# EAGLE schematic MotorControl (EAGLE 9.6.2)
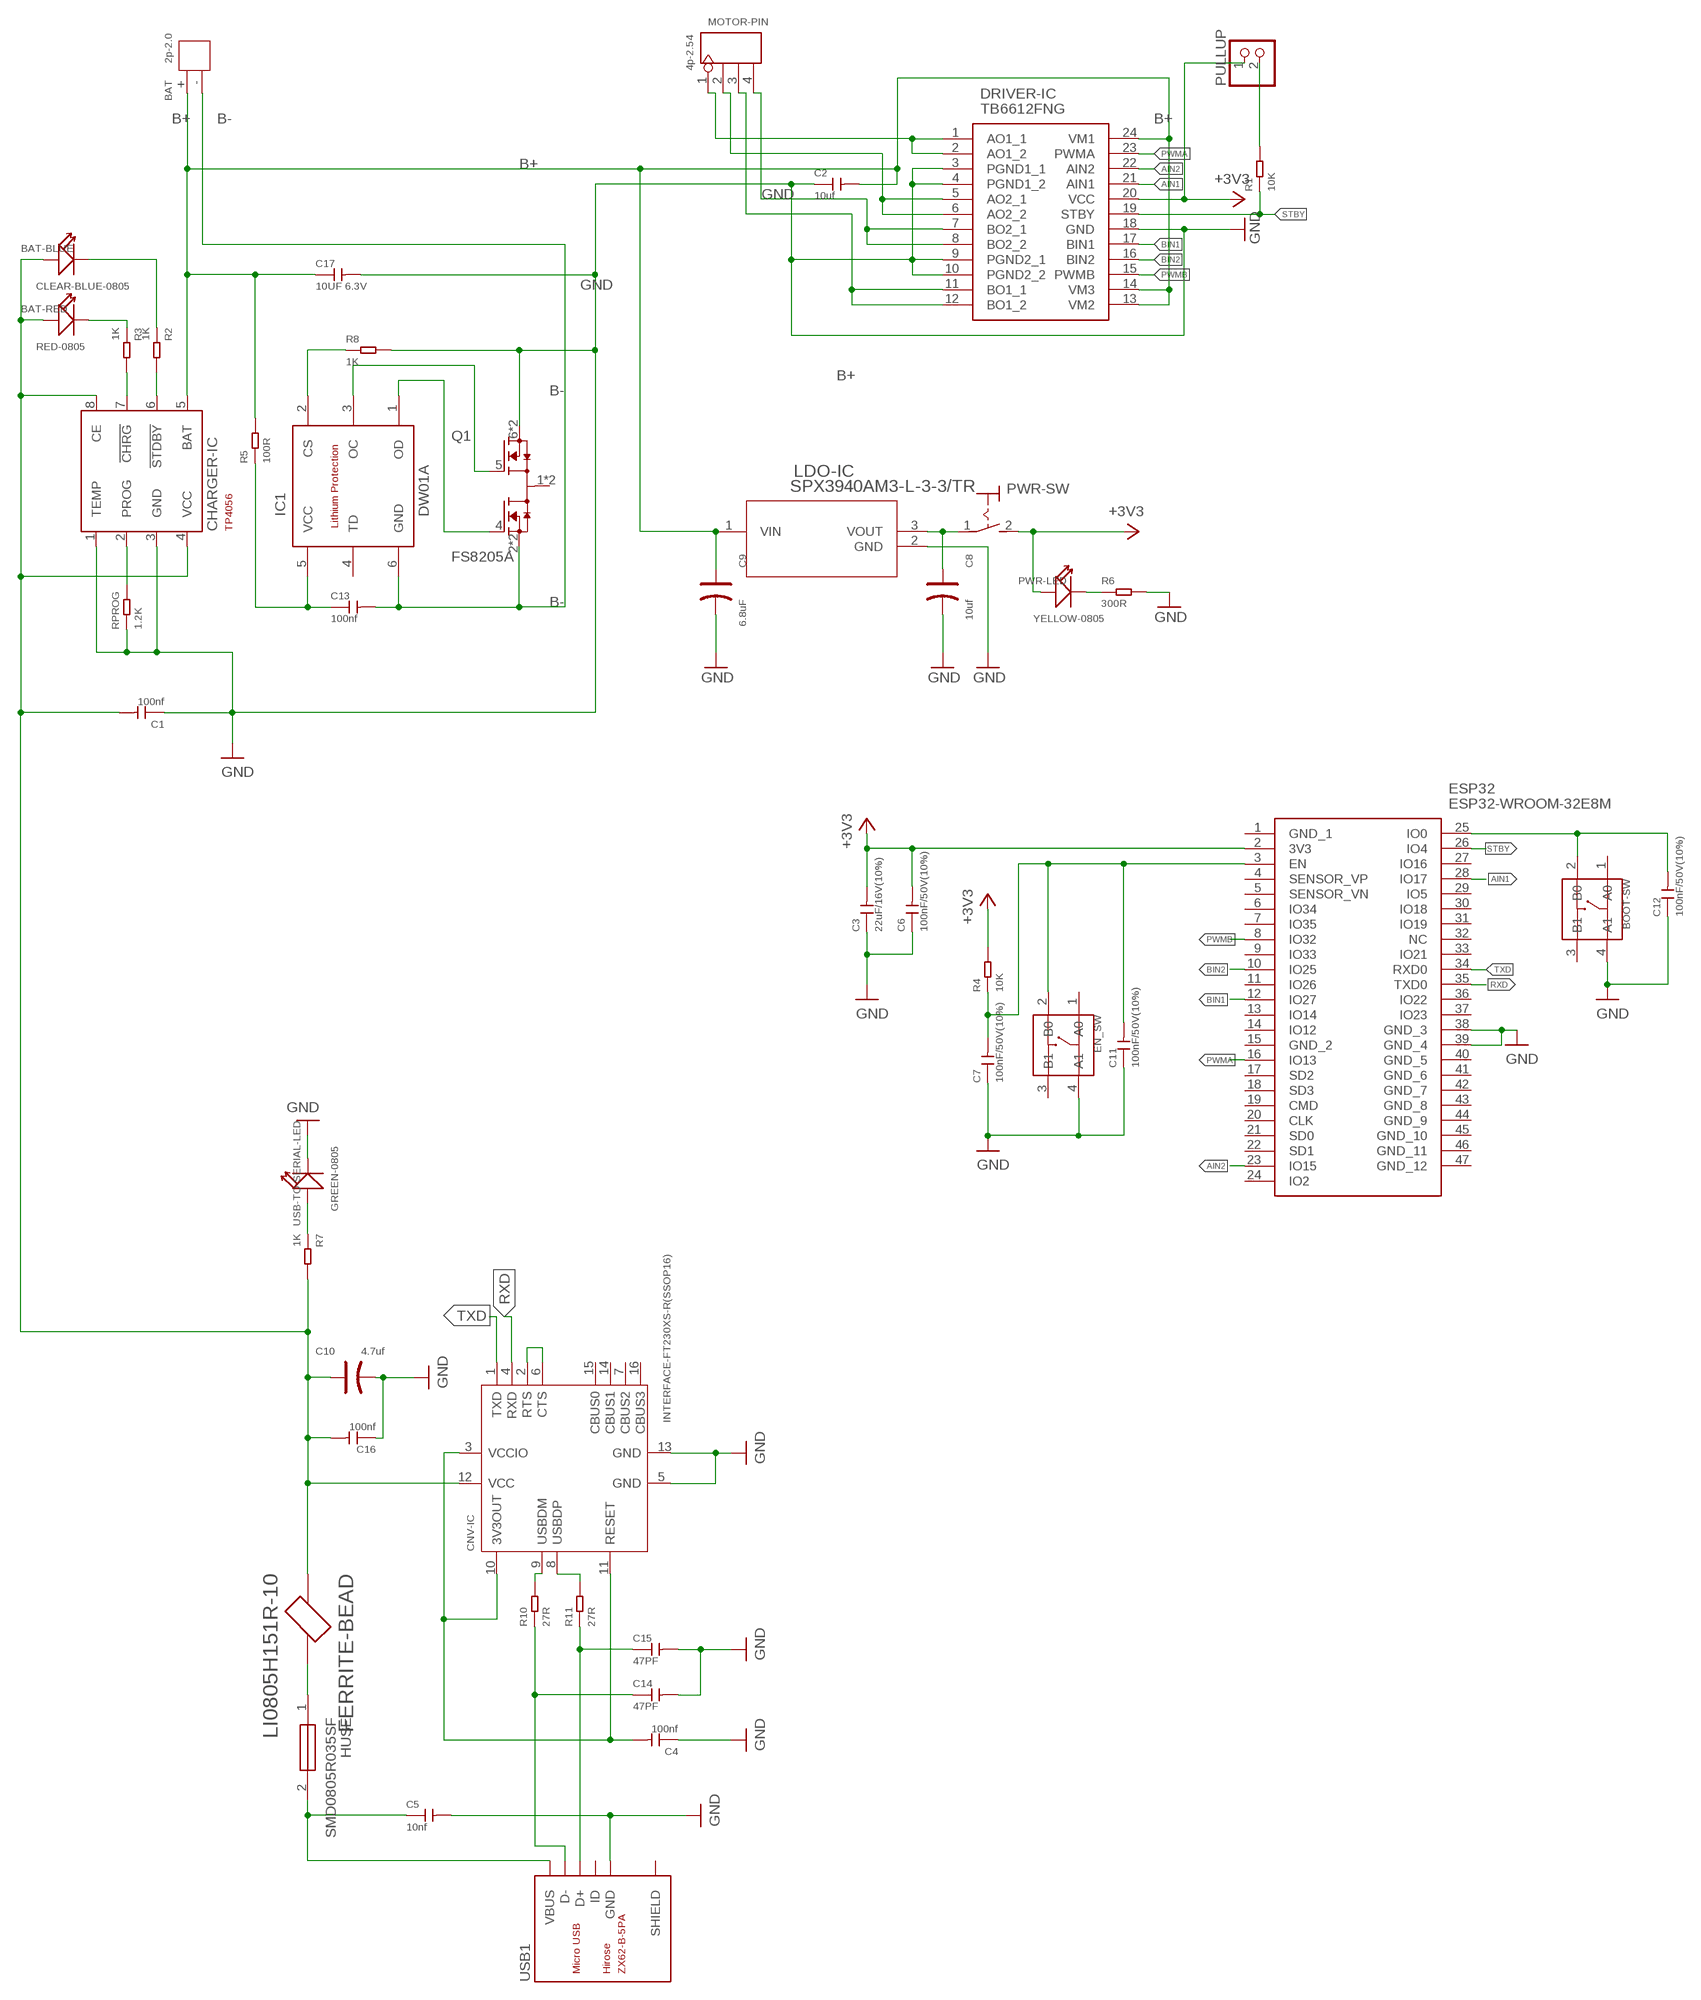
[diagram p0: schematic, sheet 1]

## Parts
BAT  2p-2.0  DIP-JST-2P-2.0  [H2-2.0-6X4.5MM]
BAT-BLUE  CLEAR-BLUE-0805  SMD-LED-CLEAR-BLUE(0805)  [LED-0805]
BAT-RED  RED-0805  SMD-LED-CLEAR-RED(0805)  [LED-0805]
BOOT-SW  SMD-SWITCH-TACTILE-SPST-NO(4P-D6.0MM)  [SW4-SMD-6.0X6.0X5.0MM]
C1  100nf  CERAMIC-100NF-50V-10%-X7R(0805)  [C0805]
C2  10uf  CERAMIC-10UF-25V-10%-X5R(1206)  [C1206]
C3  22uF/16V(10%)  CERAMIC-22UF-16V-10%-X7R(1206)  [C1206]
C4  100nf  CERAMIC-100NF-50V-10%-X7R(0805)  [C0805]
C5  10nf  CERAMIC-10NF-50V-5%-X7R(0805)  [C0805]
C6  100nF/50V(10%)  CERAMIC-100NF-50V-10%-X7R(0603)  [C0603]
C7  100nF/50V(10%)  CERAMIC-100NF-50V-10%-X7R(0603)  [C0603]
C8  10uf  TANTALUM-SMD-10UF-16V-10%(AVX-A)  [AVX-A]
C9  6.8uF  TCJB685M025R0150-SELFMADE  [CAPPM3528X210N]
C10  4.7uf  TANTALUM-SMD-4.7UF-16V(AVX-A)  [AVX-A]
C11  100nF/50V(10%)  CERAMIC-100NF-50V-10%-X7R(0603)  [C0603]
C12  100nF/50V(10%)  CERAMIC-100NF-50V-10%-X7R(0603)  [C0603]
C13  100nf  CERAMIC-100NF-50V-10%-X7R(0805)  [C0805]
C14  47PF  CERAMIC-47PF-50V-5%-NP0(0402)  [C0402]
C15  47PF  CERAMIC-47PF-50V-5%-NP0(0402)  [C0402]
C16  100nf  CERAMIC-100NF-50V-10%-X7R(0805)  [C0805]
C17  10UF 6.3V  CERAMIC-10UF-6.3V-20%-X5R(0603)  [C0603]
CHARGER-IC  TP4056  [SOT23-8]
CNV-IC  INTERFACE-FT230XS-R(SSOP16)  [SSOP16-0.635-5X4MM]
DRIVER-IC  TB6612FNG  [SOP65P760X160-24N]
EN_SW  SMD-SWITCH-TACTILE-SPST-NO(4P-D6.0MM)  [SW4-SMD-6.0X6.0X5.0MM]
ESP32  ESP32-WROOM-32E8M  [ESP32WROOM32E8MB]
FERRITE-BEAD  LI0805H151R-10  [FB_LI0805H151R-10]
HUSE  SMD0805R035SF  [SMD0805R035SF]
IC1  DW01A  [SOT23-6]
LDO-IC  SPX3940AM3-L-3-3/TR  [SOT-223-3_VAR-AA]
MOTOR-PIN  4p-2.54  DIP-BLACK-FEMALE-HEADER-VERT(4P-2.54)  [H4-2.54]
PULLUP  PINHD-1X2  [1X02]
PWR-LED  YELLOW-0805  SMD-LED-CLEAR-YELLOW(0805)  [LED-0805]
PWR-SW  MS243  [MS243]
Q1  FS8205A  [SOP65P640X120-8N]
R1  10K  SMD-RES-10K-1%-1/10W(0603)  [R0603]
R2  1K  SMD-RES-1K-1%-1/10W(0603)  [R0603]
R3  1K  SMD-RES-1K-1%-1/10W(0603)  [R0603]
R4  10K  SMD-RES-10K-1%-1/10W(0603)  [R0603]
R5  100R  SMD-RES-100R-5%-1/4W(1206)  [R1206]
R6  300R  SMD-RES-300R-1%-1/10W(0603)  [R0603]
R7  1K  SMD-RES-1K-1%-1/10W(0603)  [R0603]
R8  1K  SMD-RES-1K-5%-1/8W(0805)  [R0805]
R10  27R  SMD-RES-27R-1%-1/8W(0805)  [R0805]
R11  27R  SMD-RES-27R-1%-1/8W(0805)  [R0805]
RPROG  1.2K  SMD-RES-1.2K-1%-1/8W(0805)  [R0805]
USB1  ZX62-B-5PA  MICRO-USB-SMD(ZX62-B-5PA)  [MICRO-USB5+6P-SMD-0.65-AB]
USB-TO-SERIAL-LED  GREEN-0805  SMD-LED-CLEAR-GREEN(0805)  [LED-0805]

## Nets
+3V3 [Power]: C3.2 C6.2 DRIVER-IC.20(VCC) ESP32.2(3V3) PULLUP.1 PWR-LED.+ PWR-SW.2(S) R4.2
AIN1: DRIVER-IC.21(AIN1) ESP32.28(IO17)
AIN2: DRIVER-IC.22(AIN2) ESP32.23(IO15)
AO1 [Motor]: DRIVER-IC.1(AO1_1) DRIVER-IC.2(AO1_2) MOTOR-PIN.1
AO2 [Motor]: DRIVER-IC.5(AO2_1) DRIVER-IC.6(AO2_2) MOTOR-PIN.2
B+ [Power]: BAT.+ C2.2 C9.1(+) C17.1 CHARGER-IC.5(BAT) DRIVER-IC.13(VM2) DRIVER-IC.14(VM3) DRIVER-IC.24(VM1) LDO-IC.1(VIN) R5.2
B- [Power]: BAT.- C13.2 IC1.6(GND) Q1.2(S1) Q1.3(S1)
BIN1: DRIVER-IC.17(BIN1) ESP32.12(IO27)
BIN2: DRIVER-IC.16(BIN2) ESP32.10(IO25)
BO1 [Motor]: DRIVER-IC.11(BO1_1) DRIVER-IC.12(BO1_2) MOTOR-PIN.3
BO2 [Motor]: DRIVER-IC.7(BO2_1) DRIVER-IC.8(BO2_2) MOTOR-PIN.4
GND [Power]: BOOT-SW.4(A1) C1.1 C2.1 C3.1 C4.1 C5.2 C6.1 C7.1 C8.- C9.2(-) C10.- C11.1 C12.1 C14.2 C15.2 C16.1 C17.2 CHARGER-IC.1(TEMP) CHARGER-IC.3(GND) CNV-IC.5(GND) CNV-IC.13(GND) DRIVER-IC.3(PGND1_1) DRIVER-IC.4(PGND1_2) DRIVER-IC.9(PGND2_1) DRIVER-IC.10(PGND2_2) DRIVER-IC.18(GND) EN_SW.4(A1) ESP32.38(GND_3) ESP32.39(GND_4) LDO-IC.2(GND) Q1.6(S2) Q1.7(S2) R6.2 R8.2 RPROG.1 USB1.5(GND) USB-TO-SERIAL-LED.-
N$1: IC1.3(OC) Q1.5(G2)
N$2: BAT-RED.- R3.1
N$3: R7.1 USB-TO-SERIAL-LED.+
N$4: FERRITE-BEAD.2 HUSE.1
N$5: C4.2 CNV-IC.3(VCCIO) CNV-IC.10(3V3OUT) CNV-IC.11(RESET)
N$6: CNV-IC.2(RTS) CNV-IC.6(CTS)
N$7: CNV-IC.9(USBDM) R10.2
N$8: CNV-IC.8(USBDP) R11.2
N$9: C14.1 R10.1 USB1.2(D-)
N$10: IC1.1(OD) Q1.4(G1)
N$11: CHARGER-IC.7(!CHRG) R3.2
N$12: CHARGER-IC.6(!STDBY) R2.2
N$13: BAT-BLUE.- R2.1
N$14: PWR-LED.- R6.1
N$15: C15.1 R11.1 USB1.3(D+)
N$16: CHARGER-IC.2(PROG) RPROG.2
N$18: C13.1 IC1.5(VCC) R5.1
N$19: IC1.2(CS) R8.1
N$25: PULLUP.2 R1.2
N$29: C7.2 C11.2 EN_SW.2(B0) ESP32.3(EN) R4.1
N$30: BOOT-SW.2(B0) C12.2 ESP32.25(IO0)
POWER_SW: C8.+ LDO-IC.3(VOUT) PWR-SW.1(P)
PWMA: DRIVER-IC.23(PWMA) ESP32.16(IO13)
PWMB: DRIVER-IC.15(PWMB) ESP32.8(IO32)
RXD: CNV-IC.4(RXD) ESP32.35(TXD0)
STBY: DRIVER-IC.19(STBY) ESP32.26(IO4) R1.1
TXD: CNV-IC.1(TXD) ESP32.34(RXD0)
VBUS [Power]: C5.1 HUSE.2 USB1.1(VBUS)
VIN+ [Power]: BAT-BLUE.+ BAT-RED.+ C1.2 C10.+ C16.2 CHARGER-IC.4(VCC) CHARGER-IC.8(CE) CNV-IC.12(VCC) FERRITE-BEAD.1 R7.2
Unconnected: BOOT-SW.1(A0) BOOT-SW.3(B1) CNV-IC.7(CBUS2) CNV-IC.14(CBUS1) CNV-IC.15(CBUS0) CNV-IC.16(CBUS3) EN_SW.1(A0) EN_SW.3(B1) ESP32.1(GND_1) ESP32.4(SENSOR_VP) ESP32.5(SENSOR_VN) ESP32.6(IO34) ESP32.7(IO35) ESP32.9(IO33) ESP32.11(IO26) ESP32.13(IO14) ESP32.14(IO12) ESP32.15(GND_2) ESP32.17(SD2) ESP32.18(SD3) ESP32.19(CMD) ESP32.20(CLK) ESP32.21(SD0) ESP32.22(SD1) ESP32.24(IO2) ESP32.27(IO16) ESP32.29(IO5) ESP32.30(IO18) ESP32.31(IO19) ESP32.32(NC) ESP32.33(IO21) ESP32.36(IO22) ESP32.37(IO23) ESP32.40(GND_5) ESP32.41(GND_6) ESP32.42(GND_7) ESP32.43(GND_8) ESP32.44(GND_9) ESP32.45(GND_10) ESP32.46(GND_11) ESP32.47(GND_12) IC1.4(TD) Q1.1(D12) Q1.8(D12) USB1.4(ID) USB1.P1(SHIELD) USB1.P2(SHIELD) USB1.P3(SHIELD) USB1.P4(SHIELD) USB1.P5(SHIELD) USB1.P6(SHIELD)

## Library data of the parts
BAT = OPL_Connector:DIP-JST-2P-2.0: 320110049
BAT-BLUE = OPL_Optoelectronics:SMD-LED-CLEAR-BLUE(0805): 304090061; MPN: EL-17-215/BHC-AN1P2/3T
BAT-RED = OPL_Optoelectronics:SMD-LED-CLEAR-RED(0805): 304090046; MPN: 17-215SURC/S530-A2/TR8
BOOT-SW EN_SW = OPL_Switch:SMD-SWITCH-TACTILE-SPST-NO(4P-D6.0MM): 311020004; MPN: DTSM-62K-S-V-T/R(SN431)
C1 C4 C13 C16 = OPL_Capacitor:CERAMIC-100NF-50V-10%-X7R(0805): 302010165; MPN: CC0805KRX7R9BB104
C2 = OPL_Capacitor:CERAMIC-10UF-25V-10%-X5R(1206): 302010181; MPN: CC1206KKX5R8BB106
C3 = OPL_Capacitor:CERAMIC-22UF-16V-10%-X7R(1206): 302010182
C5 = OPL_Capacitor:CERAMIC-10NF-50V-5%-X7R(0805): 302010175; MPN: CC0805JRX7R9BB103
C6 C7 C11 C12 = OPL_Capacitor:CERAMIC-100NF-50V-10%-X7R(0603): 302010138; MPN: CC0603KRX7R9BB104; VALUE: 100nf
C8 = OPL_Capacitor:TANTALUM-SMD-10UF-16V-10%(AVX-A): 302020002; MPN: TAJA106K016RNJ
C9 = TCJB685M025R0150:TCJB685M025R0150-SELFMADE; MPN: TCJB685M025R0150
C10 = OPL_Capacitor:TANTALUM-SMD-4.7UF-16V(AVX-A): 302020006; MPN: TAJA475*016#NJ
C14 C15 = OPL_Capacitor:CERAMIC-47PF-50V-5%-NP0(0402): 302010007; MPN: CC0402JRNPO9BN470
C17 = OPL_Capacitor:CERAMIC-10UF-6.3V-20%-X5R(0603): 302010286; MPN: CC0603MRX5R5BB106
CHARGER-IC = TP4056:TP4056: TP4056 Data sheet <http://goo.gl/J7k8TF> Dave.Calaway Eagle Library <https://goo.gl/Muy1Tr>
CNV-IC = INTERFACE-FT230XS-R_SSOP16_:INTERFACE-FT230XS-R(SSOP16): 310070030 Check prices <https://pricing.snapeda.com/parts/FT230XS-R/FTDI%2C/view-part?ref=eda>; AVAILABILITY: In Stock; DESCRIPTION: USB Bridge, USB to UART USB 2.0 UART Interface 16-SSOP; MF: FTDI,; MP: FT230XS-R; PACKAGE: SSOP-16 FTDI; PRICE: None; PURCHASE-URL: https://pricing.snapeda.com/search/part/FT230XS-R/?ref=eda
DRIVER-IC = TB6612FNG:TB6612FNG: Brush motor driver IC Source: Datasheet <https://datasheet.datasheetarchive.com/originals/distributors/SFDatasheet-6/sf-000138015.pdf>; DESCRIPTION: Brush motor driver IC; HEIGHT: 1.6mm; MANUFACTURER_NAME: Toshiba; MANUFACTURER_PART_NUMBER: TB6612FNG
ESP32 = ESP32-WROOM-32:ESP32-WROOM-32E: WiFi Modules (802.11) Mod 8 MB SPI flash PCB antenna Source: Datasheet <https://www.espressif.com/sites/default/files/documentation/esp32-wroom-32_datasheet_en.pdf>; DESCRIPTION: WiFi Modules (802.11) Mod 8 MB SPI flash PCB antenna; HEIGHT: 3.2mm; MANUFACTURER_NAME: Espressif Systems; MANUFACTURER_PART_NUMBER: ESP32-WROOM-32E (8MB); MOUSER_PART_NUMBER: 356-ESP32WRM32E164PH; MOUSER_PRICE-STOCK: https://www.mouser.co.uk/ProductDetail/Espressif-Systems/ESP32-WROOM-32E-8MB?qs=GBLSl2AkirsjshqvD9slKA%3D%3D
FERRITE-BEAD = LI0805H151R-10:LI0805H151R-10: Check prices <https://pricing.snapeda.com/parts/LI0805H151R-10/Laird-Signal%20Integrity/view-part?ref=eda>; AVAILABILITY: In Stock; DESCRIPTION: 150 Ohms @ 100MHz 1 Power, Signal Line Ferrite Bead 0805 (2012 Metric) 800mA 150mOhm; MF: Laird-Signal Integrity; MP: LI0805H151R-10; PACKAGE: 0805 Laird; PRICE: None; PURCHASE-URL: https://pricing.snapeda.com/search/part/LI0805H151R-10/?ref=eda
HUSE = SMD0805R035SF:SMD0805R035SF: PTC Resettable Fuse 0.35A(hold) 0.75A(trip) 6V 40A 0.5W 0.1s 0.2Ohm SMD Solder Pad 0603 T/R Automotive Source: Datasheet <https://statics3.seeedstudio.com/images/opl/datasheet/307020109.pdf>
IC1 = DW01A:DW01A: Check prices <https://pricing.snapeda.com/parts/DW01A/Fortune%20Semiconductor/view-part?ref=eda>; AVAILABILITY: No availability data; DESCRIPTION: One Cell Lithium-ion/Polymer Battery Protection IC; MF: Fortune Semiconductor; MP: DW01A; PACKAGE: SOT-23-6 Fortune Semiconductor; PRICE: None
LDO-IC = SPX3940AM3-L-3-3:TR:SPX3940AM3-L-3-3/TR; BUILT_BY: EMA_Jessica; COPYRIGHT: Copyright (C) 2018 Accelerated Designs. All rights reserved; MANUFACTURER_PART_NUMBER: SPX3940AM3-L-3-3/TR; SOURCELIBRARY: Exar_2019-09-16; VENDOR: Exar
MOTOR-PIN = OPL_Connector:DIP-BLACK-FEMALE-HEADER-VERT(4P-2.54): 320030017; MPN: F185-1104A1BSYA1
PULLUP = pinhead:PINHD-1X2: PIN HEADER
PWR-LED = OPL_Optoelectronics:SMD-LED-CLEAR-YELLOW(0805): 304090039; MPN: 17-215UYC/S530-A3/TR8
PWR-SW = switch:MS243: TOGGLE SWITCH
Q1 = FS8205A:FS8205A: N/A Check prices <https://pricing.snapeda.com/parts/FS8205A/Fortune%20Semiconductor/view-part?ref=eda>; AVAILABILITY: No availability data; MF: Fortune Semiconductor; MP: FS8205A; PACKAGE: Package; PRICE: None
R1 R4 = OPL_Resistor:SMD-RES-10K-1%-1/10W(0603): 301011970; MPN: RC0603FR-0710KL
R2 R3 R7 = OPL_Resistor:SMD-RES-1K-1%-1/10W(0603): 301011969; MPN: RC0603FR-071KL
R5 = OPL_Resistor:SMD-RES-100R-5%-1/4W(1206): 301010412; MPN: RC1206JR-07100RL
R6 = OPL_Resistor:SMD-RES-300R-1%-1/10W(0603): 301012063; MPN: RC0603FR-071K5L; VALUE: 1.5K
R8 = OPL_Resistor:SMD-RES-1K-5%-1/8W(0805): 301012189; MPN: RC0805JR-071KL
R10 R11 = OPL_Resistor:SMD-RES-27R-1%-1/8W(0805): 301012162; MPN: RC0805JR-071KL; VALUE: 1K
RPROG = OPL_Resistor:SMD-RES-1.2K-1%-1/8W(0805): 301012155; MPN: RC0805JR-071KL; VALUE: 1K
USB1 = OPL_Connector:MICRO-USB-SMD(ZX62-B-5PA): 320010005; MPN: ZX62-B-5PA
USB-TO-SERIAL-LED = OPL_Optoelectronics:SMD-LED-CLEAR-GREEN(0805): 304090057; MPN: 17-215SYGC/S530-E2/TR8

## Net classes
0 default: width 0.356 mm, clearance 0.305 mm
1 Power: width 0.864 mm, clearance 0.508 mm
2 Motor: width 0.508 mm, clearance 0.356 mm